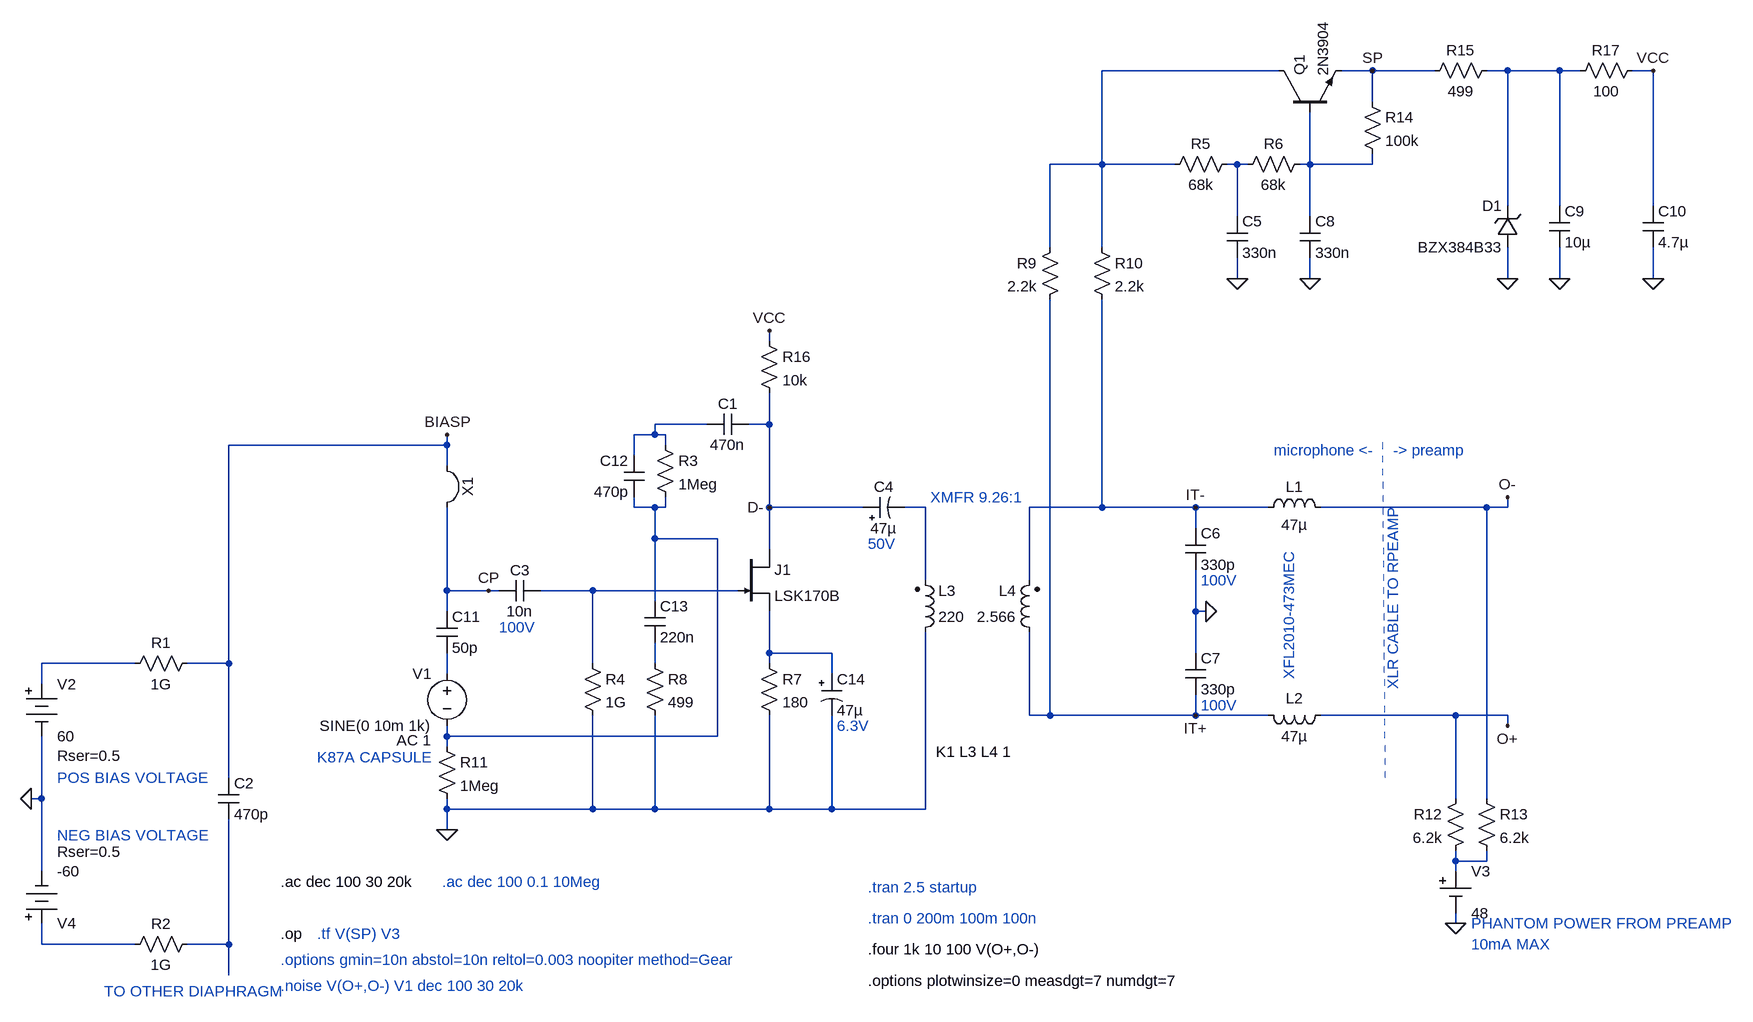
[diagram p0: schematic capsule_bias.asc]
capsule_bias.asc, the LTspice schematic file:
Version 4
SHEET 1 2184 1248
WIRE 1072 -432 800 -432
WIRE 1216 -432 1168 -432
WIRE 1312 -432 1216 -432
WIRE 1424 -432 1392 -432
WIRE 1504 -432 1424 -432
WIRE 1536 -432 1504 -432
WIRE 1648 -432 1616 -432
WIRE 1216 -384 1216 -432
WIRE 800 -288 800 -432
WIRE 800 -288 720 -288
WIRE 912 -288 800 -288
WIRE 1008 -288 992 -288
WIRE 1024 -288 1008 -288
WIRE 1120 -288 1120 -368
WIRE 1120 -288 1104 -288
WIRE 1216 -288 1216 -304
WIRE 1216 -288 1120 -288
WIRE 1424 -224 1424 -432
WIRE 1504 -224 1504 -432
WIRE 1648 -224 1648 -432
WIRE 1008 -208 1008 -288
WIRE 1120 -208 1120 -288
WIRE 720 -160 720 -288
WIRE 800 -160 800 -288
WIRE 1008 -112 1008 -144
WIRE 1120 -112 1120 -144
WIRE 1424 -112 1424 -160
WIRE 1504 -112 1504 -160
WIRE 1648 -112 1648 -160
WIRE 288 -16 288 -32
WIRE 192 112 112 112
WIRE 288 112 288 64
WIRE 288 112 256 112
WIRE 112 128 112 112
WIRE 112 128 80 128
WIRE 128 128 112 128
WIRE -208 144 -208 128
WIRE -208 144 -544 144
WIRE 128 144 128 128
WIRE 80 160 80 128
WIRE -208 176 -208 144
WIRE 80 240 80 224
WIRE 112 240 80 240
WIRE 128 240 128 224
WIRE 128 240 112 240
WIRE 288 240 288 112
WIRE 432 240 288 240
WIRE 528 240 496 240
WIRE 800 240 800 -80
WIRE 800 240 688 240
WIRE 944 240 800 240
WIRE 1056 240 944 240
WIRE 1392 240 1136 240
WIRE 1424 240 1424 224
WIRE 1424 240 1392 240
WIRE 944 272 944 240
WIRE 112 288 112 240
WIRE 208 288 112 288
WIRE 288 304 288 240
WIRE 528 352 528 240
WIRE 688 352 688 240
WIRE -208 368 -208 240
WIRE -144 368 -208 368
WIRE -128 368 -144 368
WIRE 16 368 -64 368
WIRE 240 368 16 368
WIRE 112 384 112 288
WIRE -208 400 -208 368
WIRE 944 400 944 336
WIRE 960 400 944 400
WIRE 288 464 288 400
WIRE 384 464 288 464
WIRE 944 464 944 400
WIRE -688 480 -832 480
WIRE -544 480 -544 144
WIRE -544 480 -608 480
WIRE 16 480 16 368
WIRE 112 480 112 448
WIRE 288 480 288 464
WIRE -208 496 -208 464
WIRE 384 496 384 464
WIRE -832 512 -832 480
WIRE 688 560 688 432
WIRE 720 560 720 -80
WIRE 720 560 688 560
WIRE 944 560 944 528
WIRE 944 560 720 560
WIRE 1056 560 944 560
WIRE 1344 560 1136 560
WIRE 1424 560 1344 560
WIRE 1424 576 1424 560
WIRE -208 592 -208 576
WIRE 208 592 208 288
WIRE 208 592 -208 592
WIRE -208 608 -208 592
WIRE -544 656 -544 480
WIRE -832 688 -832 592
WIRE -832 688 -848 688
WIRE 1344 688 1344 560
WIRE 1392 688 1392 240
WIRE -208 704 -208 688
WIRE 16 704 16 560
WIRE 16 704 -208 704
WIRE 112 704 112 560
WIRE 112 704 16 704
WIRE 288 704 288 560
WIRE 288 704 112 704
WIRE 384 704 384 560
WIRE 384 704 288 704
WIRE 528 704 528 432
WIRE 528 704 384 704
WIRE -208 736 -208 704
WIRE 1344 784 1344 768
WIRE 1392 784 1392 768
WIRE 1392 784 1344 784
WIRE -832 800 -832 688
WIRE 1344 800 1344 784
WIRE 1344 880 1344 864
WIRE -832 912 -832 880
WIRE -688 912 -832 912
WIRE -544 912 -544 720
WIRE -544 912 -608 912
WIRE -544 960 -544 912
FLAG -208 128 BIASP
FLAG 960 400 0
FLAG 1424 224 O-
FLAG 1424 576 O+
FLAG 1344 880 0
FLAG -144 368 CP
FLAG 288 240 D-
FLAG 288 -32 VCC
FLAG -208 736 0
FLAG 944 240 IT-
FLAG 944 560 IT+
FLAG 1120 -112 0
FLAG 1008 -112 0
FLAG 1424 -112 0
FLAG 1504 -112 0
FLAG 1648 -112 0
FLAG 1648 -432 VCC
FLAG 1216 -432 SP
FLAG -848 688 0
SYMBOL Voltage -208 480 M0
WINDOW 123 24 118 Left 2
SYMATTR Value2 AC 1
SYMATTR InstName V1
SYMATTR Value SINE(0 10m 1k)
SYMBOL Misc/battery -832 496 R0
WINDOW 39 24 126 Left 2
SYMATTR SpiceLine Rser=0.5
SYMATTR InstName V2
SYMATTR Value 60
SYMBOL Cap -560 656 R0
SYMATTR InstName C2
SYMATTR Value 470p
SYMBOL Cap -64 352 R90
WINDOW 0 0 32 VBottom 2
WINDOW 3 32 32 VTop 2
SYMATTR InstName C3
SYMATTR Value 10n
SYMBOL Res 0 464 R0
SYMATTR InstName R4
SYMATTR Value 1G
SYMBOL Res 736 -176 M0
SYMATTR InstName R9
SYMATTR Value 2.2k
SYMBOL Res 784 -176 R0
SYMATTR InstName R10
SYMATTR Value 2.2k
SYMBOL Cap 928 272 R0
SYMATTR InstName C6
SYMATTR Value 330p
SYMBOL Cap 928 528 M180
WINDOW 0 24 56 Left 2
WINDOW 3 24 8 Left 2
SYMATTR InstName C7
SYMATTR Value 330p
SYMBOL Misc/cell 1344 800 R0
SYMATTR InstName V3
SYMATTR Value 48
SYMBOL Res 272 -32 R0
SYMATTR InstName R16
SYMATTR Value 10k
SYMBOL ind 1040 256 R270
WINDOW 0 32 56 VTop 2
WINDOW 3 5 56 VBottom 2
SYMATTR InstName L1
SYMATTR Value 47µ
SYMATTR SpiceLine Rser=2.91
SYMBOL ind 1040 544 M90
WINDOW 0 5 56 VBottom 2
WINDOW 3 32 56 VTop 2
SYMATTR InstName L2
SYMATTR Value 47µ
SYMATTR SpiceLine Rser=2.91
SYMBOL njf 240 304 R0
SYMATTR InstName J1
SYMATTR Value LSK170B
SYMBOL ind2 512 448 M180
WINDOW 0 36 80 Left 2
WINDOW 3 36 40 Left 2
SYMATTR InstName L3
SYMATTR Value 220
SYMATTR Type ind
SYMATTR SpiceLine Rser=980
SYMBOL ind2 704 448 R180
WINDOW 0 36 80 Left 2
WINDOW 3 36 40 Left 2
SYMATTR InstName L4
SYMATTR Value 2.566
SYMATTR Type ind
SYMATTR SpiceLine Rser=11.43
SYMBOL polcap 432 256 R270
WINDOW 0 32 32 VTop 2
WINDOW 3 0 32 VBottom 2
SYMATTR InstName C4
SYMATTR Value 47µ
SYMBOL Res 272 464 R0
SYMATTR InstName R7
SYMATTR Value 180
SYMBOL Res 1360 672 M0
SYMATTR InstName R12
SYMATTR Value 6.2k
SYMBOL Res 1376 672 R0
SYMATTR InstName R13
SYMATTR Value 6.2k
SYMBOL Res 1008 -304 R90
WINDOW 0 0 56 VBottom 2
WINDOW 3 32 56 VTop 2
SYMATTR InstName R5
SYMATTR Value 68k
SYMBOL Cap 992 -208 R0
SYMATTR InstName C5
SYMATTR Value 330n
SYMBOL Res 1120 -304 R90
WINDOW 0 0 56 VBottom 2
WINDOW 3 32 56 VTop 2
SYMATTR InstName R6
SYMATTR Value 68k
SYMBOL Cap 1104 -208 R0
SYMATTR InstName C8
SYMATTR Value 330n
SYMBOL npn 1072 -368 R270
SYMATTR InstName Q1
SYMATTR Value 2N3904
SYMBOL Res 1200 -400 R0
SYMATTR InstName R14
SYMATTR Value 100k
SYMBOL Res 1408 -448 R90
WINDOW 0 0 56 VBottom 2
WINDOW 3 32 56 VTop 2
SYMATTR InstName R15
SYMATTR Value 499
SYMBOL zener 1440 -160 R180
WINDOW 0 24 64 Left 2
WINDOW 3 24 0 Left 2
SYMATTR InstName D1
SYMATTR Value BZX384B33
SYMBOL Cap 1488 -224 R0
SYMATTR InstName C9
SYMATTR Value 10µ
SYMBOL Res 1632 -448 R90
WINDOW 0 0 56 VBottom 2
WINDOW 3 32 56 VTop 2
SYMATTR InstName R17
SYMATTR Value 100
SYMBOL Cap 1632 -224 R0
SYMATTR InstName C10
SYMATTR Value 4.7µ
SYMBOL Cap -224 400 R0
SYMATTR InstName C11
SYMATTR Value 50p
SYMBOL Misc/battery -832 896 M180
WINDOW 39 24 126 Left 2
SYMATTR SpiceLine Rser=0.5
SYMATTR InstName V4
SYMATTR Value -60
SYMBOL Res -592 464 R90
WINDOW 0 0 56 VBottom 2
WINDOW 3 32 56 VTop 2
SYMATTR InstName R1
SYMATTR Value 1G
SYMBOL Res -592 896 R90
WINDOW 0 0 56 VBottom 2
WINDOW 3 32 56 VTop 2
SYMATTR InstName R2
SYMATTR Value 1G
SYMBOL Misc/jumper -144 208 R90
SYMATTR InstName X1
SYMBOL Cap 256 96 R90
WINDOW 0 0 32 VBottom 2
WINDOW 3 32 32 VTop 2
SYMATTR InstName C1
SYMATTR Value 470n
SYMBOL Cap 96 160 M0
SYMATTR InstName C12
SYMATTR Value 470p
SYMBOL Res 112 128 R0
SYMATTR InstName R3
SYMATTR Value 1Meg
SYMBOL Res 96 464 R0
SYMATTR InstName R8
SYMATTR Value 499
SYMBOL Cap 96 384 R0
SYMATTR InstName C13
SYMATTR Value 220n
SYMBOL polcap 368 496 R0
SYMATTR InstName C14
SYMATTR Value 47µ
SYMBOL Res -224 592 R0
SYMATTR InstName R11
SYMATTR Value 1Meg
TEXT -232 624 Right 2 ;K87A CAPSULE
TEXT -464 816 Left 2 !.ac dec 100 30 20k
TEXT -808 656 Left 2 ;POS BIAS VOLTAGE
TEXT 1248 520 VLeft 2 ;XLR CABLE TO RPEAMP
TEXT 1368 880 Left 2 ;PHANTOM POWER FROM PREAMP
TEXT -464 896 Left 2 !.op
TEXT -464 936 Left 2 ;.options gmin=10n abstol=10n reltol=0.003 noopiter method=Gear
TEXT -464 976 Left 2 ;.noise V(O+,O-) V1 dec 100 30 20k
TEXT 440 872 Left 2 ;.tran 0 200m 100m 100n
TEXT 440 920 Left 2 !.four 1k 10 100 V(O+,O-)
TEXT 440 968 Left 2 !.options plotwinsize=0 measdgt=7 numdgt=7
TEXT 1368 912 Left 2 ;10mA MAX
TEXT 1248 152 Left 2 ;-> preamp
TEXT 1064 152 Left 2 ;microphone <-
TEXT -408 896 Left 2 ;.tf V(SP) V3
TEXT 440 824 Left 2 ;.tran 2.5 startup
TEXT -216 816 Left 2 ;.ac dec 100 0.1 10Meg
TEXT 1088 304 VRight 2 ;XFL2010-473MEC
TEXT 544 616 Left 2 !K1 L3 L4 1
TEXT -808 744 Left 2 ;NEG BIAS VOLTAGE
TEXT -128 424 Left 2 ;100V
TEXT 392 576 Left 2 ;6.3V
TEXT 440 296 Left 2 ;50V
TEXT 952 352 Left 2 ;100V
TEXT 952 544 Left 2 ;100V
TEXT 536 224 Left 2 ;XMFR 9.26:1
TEXT -736 984 Left 2 ;TO OTHER DIAPHRAGM
LINE Normal 1236 656 1232 140 2

The netlist it stands for:
* capsule_bias.asc
V1 N012 N006 SINE(0 10m 1k) AC 1
V2 N010 0 60 Rser=0.5
C2 CP N015 470p
C3 N008 CP 10n
R4 N008 0 1G
R9 N001 IT+ 2.2k
R10 N001 IT- 2.2k
C6 IT- 0 330p
C7 IT+ 0 330p
V3 N013 0 48
R16 VCC D- 10k
L1 IT- O- 47µ Rser=2.91
L2 IT+ O+ 47µ Rser=2.91
J1 D- N008 N009 LSK170B
L3 0 N007 220 Rser=980
L4 IT+ IT- 2.566 Rser=11.43
C4 D- N007 47µ
R7 N009 0 180
R12 O+ N013 6.2k
R13 O- N013 6.2k
R5 N003 N001 68k
C5 N003 0 330n
R6 N004 N003 68k
C8 N004 0 330n
Q1 N001 N004 SP 0 2N3904
R14 SP N004 100k
R15 N002 SP 499
D1 0 N002 BZX384B33
C9 N002 0 10µ
R17 VCC N002 100
C10 VCC 0 4.7µ
C11 CP N012 50p
V4 N014 0 -60 Rser=0.5
R1 CP N010 1G
R2 N015 N014 1G
C1 D- N005 470n
C12 N005 N006 470p
R3 N005 N006 1Meg
R8 N011 0 499
C13 N006 N011 220n
C14 N009 0 47µ
R11 N006 0 1Meg
.model D D
.lib standard.dio
.model NPN NPN
.model PNP PNP
.lib standard.bjt
.model NJF NJF
.model PJF PJF
.lib standard.jft
* K87A CAPSULE
.ac dec 100 30 20k
* POS BIAS VOLTAGE
* XLR CABLE TO RPEAMP
* PHANTOM POWER FROM PREAMP
.op
* .options gmin=10n abstol=10n reltol=0.003 noopiter method=Gear
* .noise V(O+,O-) V1 dec 100 30 20k
* .tran 0 200m 100m 100n
.four 1k 10 100 V(O+,O-)
.options plotwinsize=0 measdgt=7 numdgt=7
* 10mA MAX
* -> preamp
* microphone <-
* .tf V(SP) V3
* .tran 2.5 startup
* .ac dec 100 0.1 10Meg
* XFL2010-473MEC
K1 L3 L4 1
* NEG BIAS VOLTAGE
* 100V
* 6.3V
* 50V
* 100V
* 100V
* XMFR 9.26:1
* TO OTHER DIAPHRAGM
.backanno
.end